# Altium schematic sheet ADC.SchDoc (part 2 of 3)
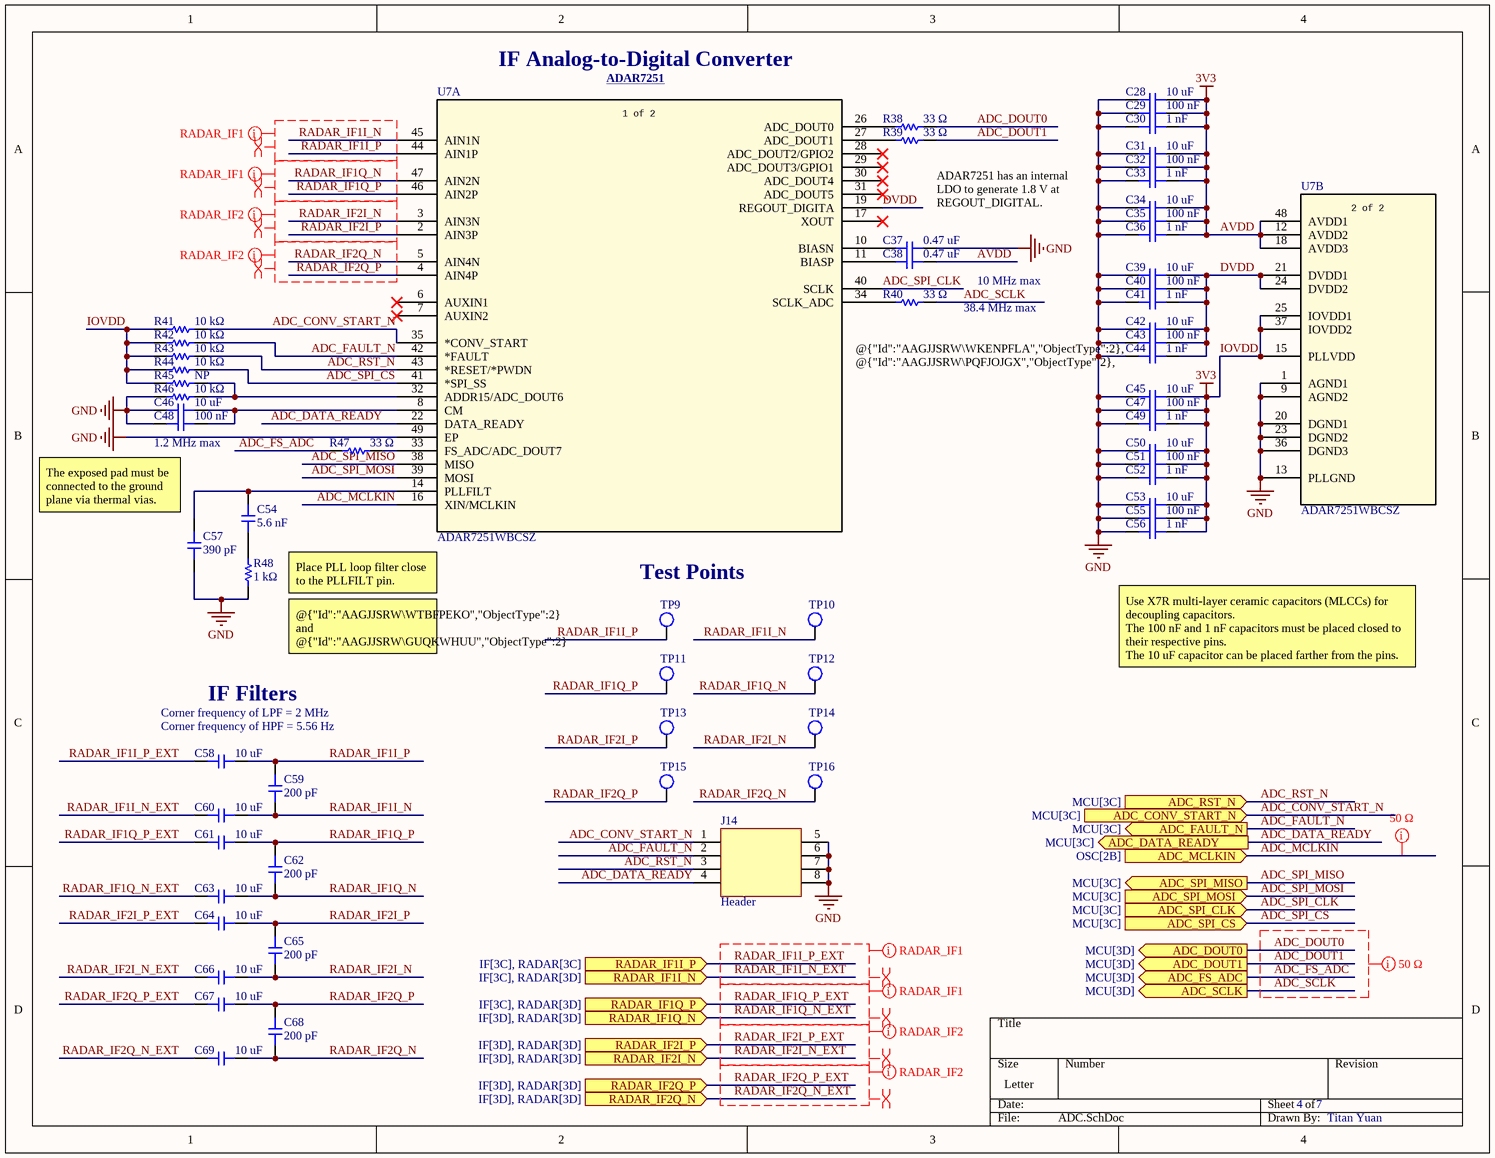
[diagram p1: ADC.SchDoc]
## Library data of the parts
C28 C31 C34 C39 C42 C45 C46 C50 C53 C58 C60 C61 C63 C64 C66 C67 C69 = CAP: 16V 10uF X7R ±10% 0805 Multilayer Ceramic Capacitors MLCC - SMD/SMT ROHS; Manufacturer: Samsung Electro-Mechanics; Manufacturer Part Number: CL21B106KOQNNNE; Value: 10µF; Tolerance: 10%; Voltage Rating: 16 V; Dielectric: Ceramic; Package Size: 0805; Supplier: DigiKey; Supplier Part Number: 1276-2872-1-ND; RoHS: Compliant; Category: Ceramic Capacitors; Stock: 2300374; Pricing: 1=0.08, 10=0.035 (USD); Case/Package: 0805; Case Code (Imperial): 0805; Case Code (Metric): 2012; China RoHS: Compliant; Contact Plating: Tin; Country of Origin: Mainland China, Philippines, South Korea; Depth: 1.25mm; Dielectric Material: Ceramic; Export Control Classification Number (ECCN) Code: EAR99; Height: 1.4mm; Harmonized Tariff Schedule (HTS) Code: 8532.24.00.20; Introduction Date: 2010-04-09; Length: 2mm; Lifecycle Status: Production; Material: Ceramic; Max Operating Temperature: 125°C; Min Operating Temperature: -55°C; Mounting Technology: Surface Mount; Number of Terminals: 2; Radiation Hardening: No; REACH SVHC: Yes; Schedule B: 8532240020, 8532240020|8532240020, 8532240020|8532240020|8532240020, 8532240020|8532240020|8532240020|8532240020; Thickness: 1.397mm; Voltage: 16V; Voltage Rating (DC): 16V; Width: 1.25mm; ComponentLink1URL: https://datasheet.octopart.com:443/CL21B106KOQNNNE-Samsung-Electro-Mechanics-datasheet-136482503.pdf?src-supplier=IHS; ComponentLink1Description: https://datasheet.octopart.com:443/CL21B106KOQNNNE-Samsung-Electro-Mechanics-datasheet-136482503.pdf?src-supplier=IHS; ComponentLink2URL: https://datasheet.octopart.com:443/CL21B106KOQNNNE-Samsung-Electro-Mechanics-datasheet-116891046.pdf?src-supplier=Future+Electronics; ComponentLink2Description: https://datasheet.octopart.com:443/CL21B106KOQNNNE-Samsung-Electro-Mechanics-datasheet-116891046.pdf?src-supplier=Future+Electronics; ComponentLink3URL: https://datasheet.octopart.com:443/CL21B106KOQNNNE-Samsung-Electro-Mechanics-datasheet-81462191.pdf?src-supplier=Future+Electronics; ComponentLink3Description: https://datasheet.octopart.com:443/CL21B106KOQNNNE-Samsung-Electro-Mechanics-datasheet-81462191.pdf?src-supplier=Future+Electronics; ComponentLink4URL: https://datasheet.octopart.com:443/CL21B106KOQNNNE-Samsung-datasheet-12530662.pdf?src-supplier=Future+Electronics; ComponentLink4Description: https://datasheet.octopart.com:443/CL21B106KOQNNNE-Samsung-datasheet-12530662.pdf?src-supplier=Future+Electronics; ComponentLink5URL: https://datasheet.octopart.com:443/CL21B106KOQNNNE-Samsung-datasheet-26669285.pdf?src-supplier=Future+Electronics; ComponentLink5Description: https://datasheet.octopart.com:443/CL21B106KOQNNNE-Samsung-datasheet-26669285.pdf?src-supplier=Future+Electronics; ComponentLink6URL: https://datasheet.octopart.com:443/CL21B106KOQNNNE-Samsung-Electro-Mechanics-datasheet-149045986.pdf?src-supplier=Future+Electronics; ComponentLink6Description: https://datasheet.octopart.com:443/CL21B106KOQNNNE-Samsung-Electro-Mechanics-datasheet-149045986.pdf?src-supplier=Future+Electronics; ComponentLink7URL: https://datasheet.octopart.com/CL21B106KOQNNNE-Samsung-Electro-Mechanics-datasheet-97040617.pdf; ComponentLink7Description: https://datasheet.octopart.com/CL21B106KOQNNNE-Samsung-Electro-Mechanics-datasheet-97040617.pdf; ComponentLink8URL: https://datasheet.octopart.com/CL21B106KOQNNNE-Samsung-Electro-Mechanics-datasheet-8324245.pdf; ComponentLink8Description: https://datasheet.octopart.com/CL21B106KOQNNNE-Samsung-Electro-Mechanics-datasheet-8324245.pdf; ComponentLink9URL: https://datasheet.octopart.com:443/CL21B106KOQNNNE-Samsung-Electro-Mechanics-datasheet-11806859.pdf?src-supplier=Arrow+Electronics; ComponentLink9Description: https://datasheet.octopart.com:443/CL21B106KOQNNNE-Samsung-Electro-Mechanics-datasheet-11806859.pdf?src-supplier=Arrow+Electronics; ComponentLink10URL: https://datasheet.octopart.com:443/CL21B106KOQNNNE-Samsung-datasheet-8326407.pdf?src-supplier=TME; ComponentLink10Description: https://datasheet.octopart.com:443/CL21B106KOQNNNE-Samsung-datasheet-8326407.pdf?src-supplier=TME
C29 C32 C35 C40 C43 C47 C48 C51 C55 = CAP: 25V 100nF X7R ±10% 0402 Multilayer Ceramic Capacitors MLCC - SMD/SMT ROHS; Manufacturer: Samsung Electro-Mechanics; Manufacturer Part Number: CL05B104KA5NNNC; Tolerance: 10%; Voltage Rating: 25 V; Dielectric: Ceramic; Package Size: 0402; Supplier: DigiKey; Supplier Part Number: 1276-6720-1-ND; RoHS: Compliant; Category: Ceramic Capacitors; Stock: 5149468; Pricing: 1=0.08, 10=0.002 (USD); Value: 100nF; Case/Package: 0402; Case Code (Imperial): 0402; Case Code (Metric): 1005; China RoHS: Compliant; Country of Origin: Mainland China, Philippines, South Korea; Dielectric Material: Ceramic; Export Control Classification Number (ECCN) Code: EAR99; Height: 500µm; Harmonized Tariff Schedule (HTS) Code: 8532.24.00.20; Introduction Date: 2009-10-27; Length: 1mm; Lifecycle Status: Production; Material: Ceramic; Max Operating Temperature: 125°C; Min Operating Temperature: -55°C; Mounting Technology: Surface Mount; Number of Terminals: 2; REACH SVHC: Yes; Schedule B: 8532240020, 8532240020|8532240020|8532240020|8532240020|8532240020|8532240020|8532240020|8532240020|8532240020|8532240020|8532240020|8532240020|8532240020|8532240020|8532240020|8532240020|8532240020|8532240020|8532240020|8532240020|8532240020|8532240020|8532240020|85; Thickness: 558.8µm; Voltage Rating (DC): 25V; Width: 500µm; ComponentLink1URL: https://datasheet.octopart.com:443/CL05B104KA5NNNC-Samsung-Electro-Mechanics-datasheet-136876160.pdf?src-supplier=Samsung+SCT; ComponentLink1Description: https://datasheet.octopart.com:443/CL05B104KA5NNNC-Samsung-Electro-Mechanics-datasheet-136876160.pdf?src-supplier=Samsung+SCT; ComponentLink2URL: https://datasheet.octopart.com:443/CL05B104KA5NNNC-Samsung-Electro-Mechanics-datasheet-116890910.pdf?src-supplier=Future+Electronics; ComponentLink2Description: https://datasheet.octopart.com:443/CL05B104KA5NNNC-Samsung-Electro-Mechanics-datasheet-116890910.pdf?src-supplier=Future+Electronics; ComponentLink3URL: https://datasheet.octopart.com:443/CL05B104KA5NNNC-Samsung-Electro-Mechanics-datasheet-104201047.pdf?src-supplier=Future+Electronics; ComponentLink3Description: https://datasheet.octopart.com:443/CL05B104KA5NNNC-Samsung-Electro-Mechanics-datasheet-104201047.pdf?src-supplier=Future+Electronics; ComponentLink4URL: https://datasheet.octopart.com:443/CL05B104KA5NNNC-Samsung-Electro-Mechanics-datasheet-148801811.pdf?src-supplier=Future+Electronics; ComponentLink4Description: https://datasheet.octopart.com:443/CL05B104KA5NNNC-Samsung-Electro-Mechanics-datasheet-148801811.pdf?src-supplier=Future+Electronics; ComponentLink5URL: https://datasheet.octopart.com/CL05B104KA5NNNC-Samsung-Electro-Mechanics-datasheet-97040617.pdf; ComponentLink5Description: https://datasheet.octopart.com/CL05B104KA5NNNC-Samsung-Electro-Mechanics-datasheet-97040617.pdf; ComponentLink6URL: https://datasheet.octopart.com/CL05B104KA5NNNC-Samsung-Electro-Mechanics-datasheet-8324245.pdf; ComponentLink6Description: https://datasheet.octopart.com/CL05B104KA5NNNC-Samsung-Electro-Mechanics-datasheet-8324245.pdf; ComponentLink7URL: https://datasheet.octopart.com/General-Multilayer-Ceramic-Capacitors-Samsung-datasheet-family-111.pdf; ComponentLink7Description: https://datasheet.octopart.com/General-Multilayer-Ceramic-Capacitors-Samsung-datasheet-family-111.pdf; ComponentLink8URL: https://datasheet.octopart.com:443/CL05B104KA5NNNC-Samsung-datasheet-8326407.pdf?src-supplier=TME; ComponentLink8Description: https://datasheet.octopart.com:443/CL05B104KA5NNNC-Samsung-datasheet-8326407.pdf?src-supplier=TME; ComponentLink9URL: http://sigma.octopart.com:80/rohs_certificate/General-Multilayer-Ceramic-Capacitors-Samsung-family-110.pdf?src-supplier=Compliance+Statements; ComponentLink9Description: http://sigma.octopart.com:80/rohs_certificate/General-Multilayer-Ceramic-Capacitors-Samsung-family-110.pdf?src-supplier=Compliance+Statements; ComponentLink10URL: http://sigma.octopart.com:80/rohs_statement/General-Multilayer-Ceramic-Capacitors-Samsung-family-132.pdf?src-supplier=Compliance+Statements; ComponentLink10Description: http://sigma.octopart.com:80/rohs_statement/General-Multilayer-Ceramic-Capacitors-Samsung-family-132.pdf?src-supplier=Compliance+Statements; ComponentLink11URL: http://sigma.octopart.com:80/reach_statement/General-Multilayer-Ceramic-Capacitors-Samsung-family-133.pdf?src-supplier=Compliance+Statements; ComponentLink11Description: http://sigma.octopart.com:80/reach_statement/General-Multilayer-Ceramic-Capacitors-Samsung-family-133.pdf?src-supplier=Compliance+Statements
C30 C33 C36 C41 C44 C49 C52 C56 = CAP: 50V 1nF X7R ±10% 0402 Multilayer Ceramic Capacitors MLCC - SMD/SMT ROHS; Manufacturer: Yageo; Manufacturer Part Number: CC0402KRX7R9BB102; Insulation Resistance: 100GΩ; Temperature Coefficient: 30ppm/°C; Tolerance: 10%; Voltage Rating: 50 V; Dielectric: Ceramic; Package Size: 0402; Supplier: DigiKey; Supplier Part Number: 311-1036-1-ND; RoHS: Compliant; Category: Ceramic Capacitors; Stock: 1584347; Pricing: 1=0.08, 10=0.003, 10000=0.0024 (USD); Value: 1nF; Case/Package: 0402; Case Code (Imperial): 0402; Case Code (Metric): 1005; China RoHS: Compliant; Composition: Ceramic; Country of Origin: Mainland China, Taiwan; Depth: 500µm; Dielectric Material: Ceramic; Export Control Classification Number (ECCN) Code: EAR99; Halogen Free: Halogen Free; Height: 500µm; Harmonized Tariff Schedule (HTS) Code: 8532.24.00.20; Introduction Date: 2003-01-27; Lead Free: Lead Free; Length: 1mm; Lifecycle Status: Production; Material: Ceramic; Max Operating Temperature: 125°C; Min Operating Temperature: -55°C; Mounting Technology: Surface Mount; Pins: 2; Number of Terminals: 2; Radiation Hardening: No; REACH SVHC: Yes; Schedule B: 8532240020, 8532240020|8532240020|8532240020|8532240020|8532240020|8532240020|8532240020|8532240020|8532240020|8532240020|8532240020|8532240020|8532240020|8532240020|8532240020|8532240020|8532240020|8532240020|8532240020|8532240020|8532240020|8532240020|8532240020|85; Termination: SMD/SMT; Thickness: 558.8µm; Voltage: 50V; Voltage Rating (AC): 50V; Voltage Rating (DC): 50V; Width: 500µm; ComponentLink1URL: https://datasheet.octopart.com:443/CC0402KRX7R9BB102-Yageo-datasheet-177165144.pdf?src-supplier=IHS; ComponentLink1Description: https://datasheet.octopart.com:443/CC0402KRX7R9BB102-Yageo-datasheet-177165144.pdf?src-supplier=IHS; ComponentLink2URL: https://datasheet.octopart.com:443/CC0402KRX7R9BB102-Yageo-datasheet-82288757.pdf?src-supplier=Upverter; ComponentLink2Description: https://datasheet.octopart.com:443/CC0402KRX7R9BB102-Yageo-datasheet-82288757.pdf?src-supplier=Upverter; ComponentLink3URL: https://datasheet.octopart.com:443/CC0402KRX7R9BB102-Yageo-datasheet-78855684.pdf?src-supplier=Upverter; ComponentLink3Description: https://datasheet.octopart.com:443/CC0402KRX7R9BB102-Yageo-datasheet-78855684.pdf?src-supplier=Upverter; ComponentLink4URL: https://datasheet.octopart.com/CC0402KRX7R9BB102-Yageo-datasheet-10883670.pdf; ComponentLink4Description: https://datasheet.octopart.com/CC0402KRX7R9BB102-Yageo-datasheet-10883670.pdf; ComponentLink5URL: https://datasheet.octopart.com/CC0402KRX7R9BB102-Yageo-datasheet-12526321.pdf; ComponentLink5Description: https://datasheet.octopart.com/CC0402KRX7R9BB102-Yageo-datasheet-12526321.pdf; ComponentLink6URL: https://datasheet.octopart.com:443/CC0402KRX7R9BB102-Yageo-datasheet-147453679.pdf?src-supplier=Farnell; ComponentLink6Description: https://datasheet.octopart.com:443/CC0402KRX7R9BB102-Yageo-datasheet-147453679.pdf?src-supplier=Farnell; ComponentLink7URL: https://datasheet.octopart.com:443/CC0402KRX7R9BB102-Yageo-datasheet-151948686.pdf?src-supplier=Farnell; ComponentLink7Description: https://datasheet.octopart.com:443/CC0402KRX7R9BB102-Yageo-datasheet-151948686.pdf?src-supplier=Farnell; ComponentLink8URL: https://datasheet.octopart.com:443/CC0402KRX7R9BB102-Phycomp-datasheet-500777.pdf?src-supplier=Farnell; ComponentLink8Description: https://datasheet.octopart.com:443/CC0402KRX7R9BB102-Phycomp-datasheet-500777.pdf?src-supplier=Farnell; ComponentLink9URL: https://datasheet.octopart.com:443/CC0402KRX7R9BB102-Yageo-datasheet-5301394.pdf?src-supplier=Newark; ComponentLink9Description: https://datasheet.octopart.com:443/CC0402KRX7R9BB102-Yageo-datasheet-5301394.pdf?src-supplier=Newark; ComponentLink10URL: https://datasheet.octopart.com:443/CC0402KRX7R9BB102-Yageo-datasheet-62336348.pdf?src-supplier=Newark; ComponentLink10Description: https://datasheet.octopart.com:443/CC0402KRX7R9BB102-Yageo-datasheet-62336348.pdf?src-supplier=Newark; ComponentLink11URL: https://datasheet.octopart.com:443/CC0402KRX7R9BB102-Yageo-datasheet-182878162.pdf?src-supplier=Newark; ComponentLink11Description: https://datasheet.octopart.com:443/CC0402KRX7R9BB102-Yageo-datasheet-182878162.pdf?src-supplier=Newark; ComponentLink12URL: https://datasheet.octopart.com:443/CC0402KRX7R9BB102-Phycomp-datasheet-499490.pdf?src-supplier=element14; ComponentLink12Description: https://datasheet.octopart.com:443/CC0402KRX7R9BB102-Phycomp-datasheet-499490.pdf?src-supplier=element14; ComponentLink13URL: https://datasheet.octopart.com:443/CC0402KRX7R9BB102-Yageo-datasheet-8701427.pdf?src-supplier=element14; ComponentLink13Description: https://datasheet.octopart.com:443/CC0402KRX7R9BB102-Yageo-datasheet-8701427.pdf?src-supplier=element14; ComponentLink14URL: https://datasheet.octopart.com:443/CC0402KRX7R9BB102-Yageo-datasheet-166511530.pdf?src-supplier=Future+Electronics; ComponentLink14Description: https://datasheet.octopart.com:443/CC0402KRX7R9BB102-Yageo-datasheet-166511530.pdf?src-supplier=Future+Electronics; ComponentLink15URL: https://datasheet.octopart.com:443/CC0402KRX7R9BB102-Yageo-datasheet-137700082.pdf?src-supplier=Future+Electronics; ComponentLink15Description: https://datasheet.octopart.com:443/CC0402KRX7R9BB102-Yageo-datasheet-137700082.pdf?src-supplier=Future+Electronics; ComponentLink16URL: https://datasheet.octopart.com:443/CC0402KRX7R9BB102-Yageo-datasheet-137700084.pdf?src-supplier=Future+Electronics; ComponentLink16Description: https://datasheet.octopart.com:443/CC0402KRX7R9BB102-Yageo-datasheet-137700084.pdf?src-supplier=Future+Electronics; ComponentLink17URL: https://datasheet.octopart.com:443/CC0402KRX7R9BB102-Yageo-datasheet-78855685.pdf?src-supplier=Future+Electronics; ComponentLink17Description: https://datasheet.octopart.com:443/CC0402KRX7R9BB102-Yageo-datasheet-78855685.pdf?src-supplier=Future+Electronics; ComponentLink18URL: https://datasheet.octopart.com:443/CC0402KRX7R9BB102-Yageo-datasheet-27626582.pdf?src-supplier=Future+Electronics; ComponentLink18Description: https://datasheet.octopart.com:443/CC0402KRX7R9BB102-Yageo-datasheet-27626582.pdf?src-supplier=Future+Electronics; ComponentLink19URL: https://datasheet.octopart.com:443/CC0402KRX7R9BB102-Yageo-datasheet-24578986.pdf?src-supplier=Future+Electronics; ComponentLink19Description: https://datasheet.octopart.com:443/CC0402KRX7R9BB102-Yageo-datasheet-24578986.pdf?src-supplier=Future+Electronics; ComponentLink20URL: https://datasheet.octopart.com:443/CC0402KRX7R9BB102-Yageo-datasheet-15895757.pdf?src-supplier=Future+Electronics; ComponentLink20Description: https://datasheet.octopart.com:443/CC0402KRX7R9BB102-Yageo-datasheet-15895757.pdf?src-supplier=Future+Electronics; ComponentLink21URL: https://datasheet.octopart.com:443/CC0402KRX7R9BB102-Yageo-datasheet-8324192.pdf?src-supplier=Future+Electronics; ComponentLink21Description: https://datasheet.octopart.com:443/CC0402KRX7R9BB102-Yageo-datasheet-8324192.pdf?src-supplier=Future+Electronics; ComponentLink22URL: https://datasheet.octopart.com:443/CC0402KRX7R9BB102-Yageo-datasheet-68298032.pdf?src-supplier=Future+Electronics; ComponentLink22Description: https://datasheet.octopart.com:443/CC0402KRX7R9BB102-Yageo-datasheet-68298032.pdf?src-supplier=Future+Electronics; ComponentLink23URL: https://datasheet.octopart.com:443/CC0402KRX7R9BB102-Yageo-datasheet-178018854.pdf?src-supplier=Burklin+Elektronik; ComponentLink23Description: https://datasheet.octopart.com:443/CC0402KRX7R9BB102-Yageo-datasheet-178018854.pdf?src-supplier=Burklin+Elektronik; ComponentLink24URL: https://datasheet.octopart.com:443/CC0402KRX7R9BB102-Yageo-Group-datasheet-165992755.pdf?src-supplier=ODG+(Origin+Data+Global); ComponentLink24Description: https://datasheet.octopart.com:443/CC0402KRX7R9BB102-Yageo-Group-datasheet-165992755.pdf?src-supplier=ODG+(Origin+Data+Global); ComponentLink25URL: https://datasheet.octopart.com:443/CC0402KRX7R9BB102-Yageo-datasheet-120101875.pdf?src-supplier=Megastar; ComponentLink25Description: https://datasheet.octopart.com:443/CC0402KRX7R9BB102-Yageo-datasheet-120101875.pdf?src-supplier=Megastar; ComponentLink26URL: https://datasheet.octopart.com:443/CC0402KRX7R9BB102-Yageo-datasheet-118396.pdf?src-supplier=DigiKey; ComponentLink26Description: https://datasheet.octopart.com:443/CC0402KRX7R9BB102-Yageo-datasheet-118396.pdf?src-supplier=DigiKey; ComponentLink27URL: http://sigma.octopart.com:80/rohs_statement/Surface-Mount-Ceramic-Multilayer-Capacitors%3B-General-Purpose-%26-High-Capacitance-Class-2%2C-X7R-Yageo-family-124.pdf?src-supplier=Compliance+Statements; ComponentLink27Description: http://sigma.octopart.com:80/rohs_statement/Surface-Mount-Ceramic-Multilayer-Capacitors%3B-General-Purpose-%26-High-Capacitance-Class-2%2C-X7R-Yageo-family-124.pdf?src-supplier=Compliance+Statements; ComponentLink28URL: http://sigma.octopart.com:80/reach_statement/Surface-Mount-Ceramic-Multilayer-Capacitors%3B-General-Purpose-%26-High-Capacitance-Class-2%2C-X7R-Yageo-family-125.pdf?src-supplier=Compliance+Statements; ComponentLink28Description: http://sigma.octopart.com:80/reach_statement/Surface-Mount-Ceramic-Multilayer-Capacitors%3B-General-Purpose-%26-High-Capacitance-Class-2%2C-X7R-Yageo-family-125.pdf?src-supplier=Compliance+Statements; ComponentLink29URL: http://sigma.octopart.com:80/conflict_mineral_statement/Yageo-company-3.pdf?src-supplier=Compliance+Statements; ComponentLink29Description: http://sigma.octopart.com:80/conflict_mineral_statement/Yageo-company-3.pdf?src-supplier=Compliance+Statements; ComponentLink30URL: http://sigma.octopart.com:80/rohs_statement/Yageo-company-2.pdf?src-supplier=Compliance+Statements; ComponentLink30Description: http://sigma.octopart.com:80/rohs_statement/Yageo-company-2.pdf?src-supplier=Compliance+Statements
C37 C38 = CAP: 0402 0.47 uF 6.3 V ±10% Tolerance X5R SMT Multilayer Ceramic Capacitor; Manufacturer: Murata Electronics; Manufacturer Part Number: GRM155R60J474KE19D; Manufacturer Lifecycle Status: NRND; Voltage Rating: 6.3 V; Value: 470nF; Insulation Resistance: 10GΩ; Voltage: 6.3V; Tolerance: 10%; Dielectric: Ceramic; Package Size: 0402; Supplier: DigiKey; Supplier Part Number: 490-3266-1-ND; RoHS: Compliant; Category: Ceramic Capacitors; Stock: 4006034; Pricing: 1=0.1, 10=0.056, 50=0.039, 100=0.0336, 500=0.02468, 1000=0.02195, 2500=0.01906, 5000=0.01733 (USD); Case/Package: 0402; Case Code (Imperial): 0402; Case Code (Metric): 1005; Depth: 500µm; Dielectric Material: Ceramic; Height: 500µm; Lead Free: Lead Free; Length: 1mm; Lifecycle Status: NRND; Max Operating Temperature: 85°C; Min Operating Temperature: -55°C; Mounting Technology: Surface Mount; Pins: 2; Number of Terminals: 2; Packaging: Cut Tape; Radiation Hardening: No; REACH SVHC: Yes; Schedule B: 8532240020, 8532240020|8532240020, 8532240020|8532240020|8532240020, 8532240020|8532240020|8532240020|8532240020; Termination: SMD/SMT; Thickness: 500µm; Voltage Rating (DC): 6.3V; Width: 500µm; ComponentLink1URL: https://datasheet.octopart.com/GRM155R60J474KE19D-Murata-datasheet-12515295.pdf; ComponentLink1Description: https://datasheet.octopart.com/GRM155R60J474KE19D-Murata-datasheet-12515295.pdf; ComponentLink2URL: https://datasheet.octopart.com/GRM155R60J474KE19D-Murata-datasheet-12510076.pdf; ComponentLink2Description: https://datasheet.octopart.com/GRM155R60J474KE19D-Murata-datasheet-12510076.pdf; ComponentLink3URL: https://datasheet.octopart.com/GRM155R60J474KE19D-Murata-datasheet-11978611.pdf; ComponentLink3Description: https://datasheet.octopart.com/GRM155R60J474KE19D-Murata-datasheet-11978611.pdf; ComponentLink4URL: https://datasheet.octopart.com/GRM155R60J474KE19D-Murata-datasheet-10025737.pdf; ComponentLink4Description: https://datasheet.octopart.com/GRM155R60J474KE19D-Murata-datasheet-10025737.pdf; ComponentLink5URL: https://datasheet.octopart.com/GRM155R60J474KE19D-Murata-datasheet-8819587.pdf; ComponentLink5Description: https://datasheet.octopart.com/GRM155R60J474KE19D-Murata-datasheet-8819587.pdf; ComponentLink6URL: https://datasheet.octopart.com:443/GRM155R60J474KE19D-Murata-datasheet-501912.pdf?src-supplier=Newark; ComponentLink6Description: https://datasheet.octopart.com:443/GRM155R60J474KE19D-Murata-datasheet-501912.pdf?src-supplier=Newark; ComponentLink7URL: https://datasheet.octopart.com:443/GRM155R60J474KE19D-Murata-datasheet-101584254.pdf?src-supplier=element14+APAC; ComponentLink7Description: https://datasheet.octopart.com:443/GRM155R60J474KE19D-Murata-datasheet-101584254.pdf?src-supplier=element14+APAC; ComponentLink8URL: https://datasheet.octopart.com:443/GRM155R60J474KE19D-Murata-datasheet-21400055.pdf?src-supplier=element14+APAC; ComponentLink8Description: https://datasheet.octopart.com:443/GRM155R60J474KE19D-Murata-datasheet-21400055.pdf?src-supplier=element14+APAC; ComponentLink9URL: https://datasheet.octopart.com:443/GRM155R60J474KE19D-Murata-datasheet-514334.pdf?src-supplier=element14; ComponentLink9Description: https://datasheet.octopart.com:443/GRM155R60J474KE19D-Murata-datasheet-514334.pdf?src-supplier=element14; ComponentLink10URL: https://datasheet.octopart.com:443/GRM155R60J474KE19D-Murata-datasheet-14396882.pdf?src-supplier=Future+Electronics; ComponentLink10Description: https://datasheet.octopart.com:443/GRM155R60J474KE19D-Murata-datasheet-14396882.pdf?src-supplier=Future+Electronics; ComponentLink11URL: https://datasheet.octopart.com:443/GRM155R60J474KE19D-Murata-datasheet-13758418.pdf?src-supplier=Future+Electronics; ComponentLink11Description: https://datasheet.octopart.com:443/GRM155R60J474KE19D-Murata-datasheet-13758418.pdf?src-supplier=Future+Electronics; ComponentLink12URL: https://datasheet.octopart.com:443/GRM155R60J474KE19D-Murata-datasheet-44106129.pdf?src-supplier=Future+Electronics; ComponentLink12Description: https://datasheet.octopart.com:443/GRM155R60J474KE19D-Murata-datasheet-44106129.pdf?src-supplier=Future+Electronics; ComponentLink13URL: https://datasheet.octopart.com:443/GRM155R60J474KE19D-Murata-datasheet-141266224.pdf?src-supplier=Ciiva; ComponentLink13Description: https://datasheet.octopart.com:443/GRM155R60J474KE19D-Murata-datasheet-141266224.pdf?src-supplier=Ciiva; ComponentLink14URL: https://datasheet.octopart.com:443/GRM155R60J474KE19D-Murata-datasheet-140689689.pdf?src-supplier=Ciiva; ComponentLink14Description: https://datasheet.octopart.com:443/GRM155R60J474KE19D-Murata-datasheet-140689689.pdf?src-supplier=Ciiva; ComponentLink15URL: https://datasheet.octopart.com:443/GRM155R60J474KE19D-Murata-datasheet-138740666.pdf?src-supplier=Ciiva; ComponentLink15Description: https://datasheet.octopart.com:443/GRM155R60J474KE19D-Murata-datasheet-138740666.pdf?src-supplier=Ciiva; ComponentLink16URL: https://datasheet.octopart.com:443/GRM155R60J474KE19D-Murata-datasheet-81455571.pdf?src-supplier=TME; ComponentLink16Description: https://datasheet.octopart.com:443/GRM155R60J474KE19D-Murata-datasheet-81455571.pdf?src-supplier=TME; ComponentLink17URL: https://datasheet.octopart.com:443/GRM155R60J474KE19D-Murata-datasheet-11801400.pdf?src-supplier=Arrow+Electronics; ComponentLink17Description: https://datasheet.octopart.com:443/GRM155R60J474KE19D-Murata-datasheet-11801400.pdf?src-supplier=Arrow+Electronics; ComponentLink18URL: https://datasheet.octopart.com:443/GRM155R60J474KE19D-Murata-datasheet-632409.pdf?src-supplier=Farnell; ComponentLink18Description: https://datasheet.octopart.com:443/GRM155R60J474KE19D-Murata-datasheet-632409.pdf?src-supplier=Farnell; ComponentLink19URL: https://datasheet.octopart.com:443/GRM155R60J474KE19D-Murata-datasheet-118811.pdf?src-supplier=DigiKey; ComponentLink19Description: https://datasheet.octopart.com:443/GRM155R60J474KE19D-Murata-datasheet-118811.pdf?src-supplier=DigiKey; ComponentLink20URL: http://sigma.octopart.com:80/reach_statement/Murata-company-16.pdf?src-supplier=Compliance+Statements; ComponentLink20Description: http://sigma.octopart.com:80/reach_statement/Murata-company-16.pdf?src-supplier=Compliance+Statements
C54 = CAP: 50V 5.6nF C0G ±5% 0402 Multilayer Ceramic Capacitors MLCC - SMD/SMT ROHS; Manufacturer: Murata Electronics; Manufacturer Part Number: GRM1555C1H562JE01D; Manufacturer Lifecycle Status: IN PRODUCTION; Temperature Coefficient: 30ppm/°C; Tolerance: 5%; Voltage Rating: 50 V; Dielectric: Ceramic; Package Size: 0402; Supplier: DigiKey; Supplier Part Number: 490-GRM1555C1H562JE01DCT-ND; RoHS: Compliant; Category: Ceramic Capacitors; Stock: 13616; Pricing: 1=0.1, 10=0.052, 50=0.0356, 100=0.0307, 500=0.02244, 1000=0.01991, 2500=0.01725, 5000=0.01565 (USD); Value: 5.6nF; Case/Package: 0402; Dielectric Material: Ceramic; Export Control Classification Number (ECCN) Code: EAR99; Height: 500µm; Harmonized Tariff Schedule (HTS) Code: 8532.24.00.20; Introduction Date: 2020-01-27; Length: 1mm; Lifecycle Status: Production; Material: Ceramic; Max Operating Temperature: 125°C; Min Operating Temperature: -55°C; Mounting Technology: Surface Mount; Number of Terminals: 2; REACH SVHC: Yes; Schedule B: 8532240020, 8532240020|8532240020|8532240020|8532240020|8532240020; Thickness: 500µm; Voltage Rating (DC): 50V; Width: 500µm; ComponentLink1URL: https://datasheet.octopart.com:443/GRM1555C1H562JE01D-Murata-datasheet-165579666.pdf?src-supplier=TME; ComponentLink1Description: https://datasheet.octopart.com:443/GRM1555C1H562JE01D-Murata-datasheet-165579666.pdf?src-supplier=TME; ComponentLink2URL: https://datasheet.octopart.com:443/GRM1555C1H562JE01D-Murata-datasheet-141266224.pdf?src-supplier=Ciiva; ComponentLink2Description: https://datasheet.octopart.com:443/GRM1555C1H562JE01D-Murata-datasheet-141266224.pdf?src-supplier=Ciiva; ComponentLink3URL: https://datasheet.octopart.com:443/GRM1555C1H562JE01D-Murata-datasheet-140682534.pdf?src-supplier=Ciiva; ComponentLink3Description: https://datasheet.octopart.com:443/GRM1555C1H562JE01D-Murata-datasheet-140682534.pdf?src-supplier=Ciiva; ComponentLink4URL: https://datasheet.octopart.com:443/GRM1555C1H562JE01D-Murata-datasheet-138739662.pdf?src-supplier=Ciiva; ComponentLink4Description: https://datasheet.octopart.com:443/GRM1555C1H562JE01D-Murata-datasheet-138739662.pdf?src-supplier=Ciiva; ComponentLink5URL: https://datasheet.octopart.com/GRM1555C1H562JE01D-Murata-datasheet-12515295.pdf; ComponentLink5Description: https://datasheet.octopart.com/GRM1555C1H562JE01D-Murata-datasheet-12515295.pdf; ComponentLink6URL: https://datasheet.octopart.com/GRM1555C1H562JE01D-Murata-datasheet-12510076.pdf; ComponentLink6Description: https://datasheet.octopart.com/GRM1555C1H562JE01D-Murata-datasheet-12510076.pdf; ComponentLink7URL: https://datasheet.octopart.com/GRM1555C1H562JE01D-Murata-datasheet-11978611.pdf; ComponentLink7Description: https://datasheet.octopart.com/GRM1555C1H562JE01D-Murata-datasheet-11978611.pdf; ComponentLink8URL: https://datasheet.octopart.com/GRM1555C1H562JE01D-Murata-datasheet-10025737.pdf; ComponentLink8Description: https://datasheet.octopart.com/GRM1555C1H562JE01D-Murata-datasheet-10025737.pdf; ComponentLink9URL: https://datasheet.octopart.com/GRM1555C1H562JE01D-Murata-datasheet-8819587.pdf; ComponentLink9Description: https://datasheet.octopart.com/GRM1555C1H562JE01D-Murata-datasheet-8819587.pdf; ComponentLink10URL: http://sigma.octopart.com:80/reach_statement/Murata-company-16.pdf?src-supplier=Compliance+Statements; ComponentLink10Description: http://sigma.octopart.com:80/reach_statement/Murata-company-16.pdf?src-supplier=Compliance+Statements
C57 = CAP: Capacitor, Ceramic, Multilayer, 50 V, C0G, 0.00039 Uf, Surface Mount, 0402; Manufacturer: Murata Electronics; Manufacturer Part Number: GRM1555C1H391JA01D; Manufacturer Lifecycle Status: IN PRODUCTION; Tolerance: 5%; Voltage Rating: 50 V; Value: 390pF; Temperature Coefficient: 30ppm/°C; Voltage: 50V; Dielectric: Ceramic; Package Size: 0402; Supplier: DigiKey; Supplier Part Number: 490-1296-1-ND; RoHS: Compliant; Category: Ceramic Capacitors; Stock: 144832; Pricing: 1=0.1, 10=0.033, 50=0.0224, 100=0.0191, 500=0.01364, 1000=0.01196, 2500=0.01021, 5000=0.00916 (USD); Case/Package: 0402; Case Code (Imperial): 0402; Case Code (Metric): 1005; Depth: 500µm; Dielectric Material: Ceramic; Export Control Classification Number (ECCN) Code: EAR99; Height: 500µm; Harmonized Tariff Schedule (HTS) Code: 8532.24.00.20; Introduction Date: 2003-10-14; Lead Free: Lead Free; Length: 1mm; Lifecycle Status: Production; Material: Ceramic; Max Operating Temperature: 125°C; Min Operating Temperature: -55°C; Mounting Technology: Surface Mount; Number of Terminals: 2; Packaging: Cut Tape; Radiation Hardening: No; REACH SVHC: Yes; Schedule B: 8532240020, 8532240020|8532240020, 8532240020|8532240020|8532240020, 8532240020|8532240020|8532240020|8532240020; Termination: SMD/SMT; Thickness: 500µm; Voltage Rating (DC): 50V; Width: 500µm; ComponentLink1URL: https://datasheet.octopart.com:443/GRM1555C1H391JA01D-Murata-datasheet-11756562.pdf?src-supplier=_legacy+Avnet; ComponentLink1Description: https://datasheet.octopart.com:443/GRM1555C1H391JA01D-Murata-datasheet-11756562.pdf?src-supplier=_legacy+Avnet; ComponentLink2URL: https://datasheet.octopart.com:443/GRM1555C1H391JA01D-Murata-datasheet-46741834.pdf?src-supplier=element14+APAC; ComponentLink2Description: https://datasheet.octopart.com:443/GRM1555C1H391JA01D-Murata-datasheet-46741834.pdf?src-supplier=element14+APAC; ComponentLink3URL: https://datasheet.octopart.com:443/GRM1555C1H391JA01D-Murata-datasheet-14396425.pdf?src-supplier=Future+Electronics; ComponentLink3Description: https://datasheet.octopart.com:443/GRM1555C1H391JA01D-Murata-datasheet-14396425.pdf?src-supplier=Future+Electronics; ComponentLink4URL: https://datasheet.octopart.com:443/GRM1555C1H391JA01D-Murata-datasheet-22122223.pdf?src-supplier=Future+Electronics; ComponentLink4Description: https://datasheet.octopart.com:443/GRM1555C1H391JA01D-Murata-datasheet-22122223.pdf?src-supplier=Future+Electronics; ComponentLink5URL: https://datasheet.octopart.com:443/GRM1555C1H391JA01D-Murata-datasheet-44105932.pdf?src-supplier=Future+Electronics; ComponentLink5Description: https://datasheet.octopart.com:443/GRM1555C1H391JA01D-Murata-datasheet-44105932.pdf?src-supplier=Future+Electronics; ComponentLink6URL: https://datasheet.octopart.com:443/GRM1555C1H391JA01D-Murata-datasheet-165579666.pdf?src-supplier=TME; ComponentLink6Description: https://datasheet.octopart.com:443/GRM1555C1H391JA01D-Murata-datasheet-165579666.pdf?src-supplier=TME; ComponentLink7URL: https://datasheet.octopart.com:443/GRM1555C1H391JA01D-Murata-datasheet-83054218.pdf?src-supplier=TME; ComponentLink7Description: https://datasheet.octopart.com:443/GRM1555C1H391JA01D-Murata-datasheet-83054218.pdf?src-supplier=TME; ComponentLink8URL: https://datasheet.octopart.com:443/GRM1555C1H391JA01D-Murata-datasheet-141266224.pdf?src-supplier=Ciiva; ComponentLink8Description: https://datasheet.octopart.com:443/GRM1555C1H391JA01D-Murata-datasheet-141266224.pdf?src-supplier=Ciiva; ComponentLink9URL: https://datasheet.octopart.com:443/GRM1555C1H391JA01D-Murata-datasheet-140682023.pdf?src-supplier=Ciiva; ComponentLink9Description: https://datasheet.octopart.com:443/GRM1555C1H391JA01D-Murata-datasheet-140682023.pdf?src-supplier=Ciiva; ComponentLink10URL: https://datasheet.octopart.com:443/GRM1555C1H391JA01D-Murata-datasheet-138739583.pdf?src-supplier=Ciiva; ComponentLink10Description: https://datasheet.octopart.com:443/GRM1555C1H391JA01D-Murata-datasheet-138739583.pdf?src-supplier=Ciiva; ComponentLink11URL: https://datasheet.octopart.com/GRM1555C1H391JA01D-Murata-datasheet-12515295.pdf; ComponentLink11Description: https://datasheet.octopart.com/GRM1555C1H391JA01D-Murata-datasheet-12515295.pdf; ComponentLink12URL: https://datasheet.octopart.com/GRM1555C1H391JA01D-Murata-datasheet-12510076.pdf; ComponentLink12Description: https://datasheet.octopart.com/GRM1555C1H391JA01D-Murata-datasheet-12510076.pdf; ComponentLink13URL: https://datasheet.octopart.com/GRM1555C1H391JA01D-Murata-datasheet-11978611.pdf; ComponentLink13Description: https://datasheet.octopart.com/GRM1555C1H391JA01D-Murata-datasheet-11978611.pdf; ComponentLink14URL: https://datasheet.octopart.com/GRM1555C1H391JA01D-Murata-datasheet-10025737.pdf; ComponentLink14Description: https://datasheet.octopart.com/GRM1555C1H391JA01D-Murata-datasheet-10025737.pdf; ComponentLink15URL: https://datasheet.octopart.com/GRM1555C1H391JA01D-Murata-datasheet-8819587.pdf; ComponentLink15Description: https://datasheet.octopart.com/GRM1555C1H391JA01D-Murata-datasheet-8819587.pdf; ComponentLink16URL: https://datasheet.octopart.com:443/GRM1555C1H391JA01D-Murata-datasheet-102.pdf?src-supplier=DigiKey; ComponentLink16Description: https://datasheet.octopart.com:443/GRM1555C1H391JA01D-Murata-datasheet-102.pdf?src-supplier=DigiKey; ComponentLink17URL: http://sigma.octopart.com:80/reach_statement/Murata-company-16.pdf?src-supplier=Compliance+Statements; ComponentLink17Description: http://sigma.octopart.com:80/reach_statement/Murata-company-16.pdf?src-supplier=Compliance+Statements
C59 C62 C65 C68 = CAP: Ceramic Capacitor, Multilayer, Ceramic, 50V, 5% +Tol, 5% -Tol, C0G, 0+-30ppm/Celcius TC, 200pF, Surface Mount, 0603...; Manufacturer: Samsung Electro-Mechanics; Manufacturer Part Number: CL10C201JB8NNNC; Temperature Coefficient: 30ppm/°C; Tolerance: 5%; Voltage Rating: 50 V; Dielectric: Ceramic; Package Size: 0603; Supplier: DigiKey; Supplier Part Number: 1276-2222-1-ND; RoHS: Compliant; Category: Ceramic Capacitors; Stock: 177973; Pricing: 1=0.1, 10=0.049, 50=0.0336, 100=0.0289, 500=0.02102, 1000=0.01863 (USD); Value: 200pF; Case/Package: 0603; Case Code (Imperial): 0603; Case Code (Metric): 1608; China RoHS: Compliant; Country of Origin: Mainland China, Philippines, South Korea; Depth: 800µm; Dielectric Material: Ceramic; Export Control Classification Number (ECCN) Code: EAR99; Height: 900µm; Harmonized Tariff Schedule (HTS) Code: 8532.24.00.20; Introduction Date: 2010-07-30; Length: 1.6mm; Lifecycle Status: Production; Material: Ceramic; Max Operating Temperature: 125°C; Min Operating Temperature: -55°C; Mounting Technology: Surface Mount; Number of Terminals: 2; Radiation Hardening: No; REACH SVHC: Yes; Schedule B: 8532240020, 8532240020|8532240020, 8532240020|8532240020|8532240020, 8532240020|8532240020|8532240020|8532240020; Thickness: 889µm; Voltage Rating (DC): 50V; Width: 800µm; ComponentLink1URL: https://datasheet.octopart.com:443/CL10C201JB8NNNC-Samsung-Electro-Mechanics-datasheet-137472383.pdf?src-supplier=IHS; ComponentLink1Description: https://datasheet.octopart.com:443/CL10C201JB8NNNC-Samsung-Electro-Mechanics-datasheet-137472383.pdf?src-supplier=IHS; ComponentLink2URL: https://datasheet.octopart.com:443/CL10C201JB8NNNC-Samsung-Electro-Mechanics-datasheet-110226353.pdf?src-supplier=Future+Electronics; ComponentLink2Description: https://datasheet.octopart.com:443/CL10C201JB8NNNC-Samsung-Electro-Mechanics-datasheet-110226353.pdf?src-supplier=Future+Electronics; ComponentLink3URL: https://datasheet.octopart.com:443/CL10C201JB8NNNC-Samsung-Electro-Mechanics-datasheet-81462002.pdf?src-supplier=Future+Electronics; ComponentLink3Description: https://datasheet.octopart.com:443/CL10C201JB8NNNC-Samsung-Electro-Mechanics-datasheet-81462002.pdf?src-supplier=Future+Electronics; ComponentLink4URL: https://datasheet.octopart.com:443/CL10C201JB8NNNC-Samsung-datasheet-42280589.pdf?src-supplier=Future+Electronics; ComponentLink4Description: https://datasheet.octopart.com:443/CL10C201JB8NNNC-Samsung-datasheet-42280589.pdf?src-supplier=Future+Electronics; ComponentLink5URL: https://datasheet.octopart.com:443/CL10C201JB8NNNC-Samsung-datasheet-15238953.pdf?src-supplier=Future+Electronics; ComponentLink5Description: https://datasheet.octopart.com:443/CL10C201JB8NNNC-Samsung-datasheet-15238953.pdf?src-supplier=Future+Electronics; ComponentLink6URL: https://datasheet.octopart.com:443/CL10C201JB8NNNC-Samsung-datasheet-26669146.pdf?src-supplier=Future+Electronics; ComponentLink6Description: https://datasheet.octopart.com:443/CL10C201JB8NNNC-Samsung-datasheet-26669146.pdf?src-supplier=Future+Electronics; ComponentLink7URL: https://datasheet.octopart.com:443/CL10C201JB8NNNC-Samsung-Electro-Mechanics-datasheet-149136898.pdf?src-supplier=Future+Electronics; ComponentLink7Description: https://datasheet.octopart.com:443/CL10C201JB8NNNC-Samsung-Electro-Mechanics-datasheet-149136898.pdf?src-supplier=Future+Electronics; ComponentLink8URL: https://datasheet.octopart.com/CL10C201JB8NNNC-Samsung-Electro-Mechanics-datasheet-97040617.pdf; ComponentLink8Description: https://datasheet.octopart.com/CL10C201JB8NNNC-Samsung-Electro-Mechanics-datasheet-97040617.pdf; ComponentLink9URL: https://datasheet.octopart.com/CL10C201JB8NNNC-Samsung-Electro-Mechanics-datasheet-8324245.pdf; ComponentLink9Description: https://datasheet.octopart.com/CL10C201JB8NNNC-Samsung-Electro-Mechanics-datasheet-8324245.pdf; ComponentLink10URL: https://datasheet.octopart.com:443/CL10C201JB8NNNC-Samsung-Electro-Mechanics-datasheet-11541288.pdf?src-supplier=Arrow+Electronics; ComponentLink10Description: https://datasheet.octopart.com:443/CL10C201JB8NNNC-Samsung-Electro-Mechanics-datasheet-11541288.pdf?src-supplier=Arrow+Electronics
J14 = CONN_2x4_2.54mm_PinHeader_Vertical: Pin Header, Board-to-Board, 2.54 mm, 2 Rows, 8 Contacts, Through Hole, TSW Series; Manufacturer: Samtec; Manufacturer Part Number: TSW-104-07-F-D; Manufacturer Lifecycle Status: PRODUCTION; Connector Type: Male Pin; Gender: Male; Max Current Rating: 7.6A; Max Voltage Rating (AC): 550V; Number of Contacts: 8; Pitch: 2.54mm; Supplier: DigiKey; Supplier Part Number: SAM8996-ND; RoHS: Compliant; Category: Headers and Wire Housings; Stock: 18480; Pricing: 1=0.43, 50=0.37, 100=0.31, 500=0.26, 1000=0.22, 2000=0.19, 5000=0.17, 10000=0.15 (USD); Color: Black; Contact Material: Bronze; Contact Mating Length: 5.842mm; Contact Plating: Gold; Depth: 5.08mm; Housing Color: Black; Housing Material: Polyester; Lead Pitch: 2.54mm; Length: 10.16mm; Lifecycle Status: Production; Max Operating Temperature: 125°C; Min Operating Temperature: -55°C; Mounting Technology: Through Hole; Number of Positions: 8; Number of Rows: 2; Orientation: Straight; Radiation Hardening: No; REACH SVHC: No; Row Spacing: 2.54mm; Termination: Solder; ComponentLink1URL: https://datasheet.octopart.com:443/TSW-104-07-F-D-Samtec-datasheet-97325576.pdf?src-supplier=Sager+Electronics; ComponentLink1Description: https://datasheet.octopart.com:443/TSW-104-07-F-D-Samtec-datasheet-97325576.pdf?src-supplier=Sager+Electronics; ComponentLink2URL: https://datasheet.octopart.com:443/TSW-104-07-F-D-Samtec-datasheet-151455181.pdf?src-supplier=Sager+Electronics; ComponentLink2Description: https://datasheet.octopart.com:443/TSW-104-07-F-D-Samtec-datasheet-151455181.pdf?src-supplier=Sager+Electronics; ComponentLink3URL: https://sigma.octopart.com:443/97325577/technical_drawing/Samtec-TSW-104-07-F-D.pdf?src-supplier=HQonline; ComponentLink3Description: https://sigma.octopart.com:443/97325577/technical_drawing/Samtec-TSW-104-07-F-D.pdf?src-supplier=HQonline; ComponentLink4URL: https://datasheet.octopart.com:443/TSW-104-07-F-D-Samtec-datasheet-136646178.pdf?src-supplier=Master+Electronics; ComponentLink4Description: https://datasheet.octopart.com:443/TSW-104-07-F-D-Samtec-datasheet-136646178.pdf?src-supplier=Master+Electronics; ComponentLink5URL: https://datasheet.octopart.com:443/TSW-104-07-F-D-Samtec-datasheet-182948906.pdf?src-supplier=JRH+Electronics; ComponentLink5Description: https://datasheet.octopart.com:443/TSW-104-07-F-D-Samtec-datasheet-182948906.pdf?src-supplier=JRH+Electronics; ComponentLink6URL: https://datasheet.octopart.com:443/TSW-104-07-F-D-Samtec-datasheet-160657603.pdf?src-supplier=Toby+Electronics; ComponentLink6Description: https://datasheet.octopart.com:443/TSW-104-07-F-D-Samtec-datasheet-160657603.pdf?src-supplier=Toby+Electronics; ComponentLink7URL: https://datasheet.octopart.com:443/TSW-104-07-F-D-Samtec-datasheet-116539033.pdf?src-supplier=Toby+Electronics; ComponentLink7Description: https://datasheet.octopart.com:443/TSW-104-07-F-D-Samtec-datasheet-116539033.pdf?src-supplier=Toby+Electronics; ComponentLink8URL: https://datasheet.octopart.com:443/TSW-104-07-F-D-Samtec-datasheet-116536310.pdf?src-supplier=Toby+Electronics; ComponentLink8Description: https://datasheet.octopart.com:443/TSW-104-07-F-D-Samtec-datasheet-116536310.pdf?src-supplier=Toby+Electronics; ComponentLink9URL: https://datasheet.octopart.com:443/TSW-104-07-F-D-Samtec-datasheet-116615235.pdf?src-supplier=Electro+Sonic; ComponentLink9Description: https://datasheet.octopart.com:443/TSW-104-07-F-D-Samtec-datasheet-116615235.pdf?src-supplier=Electro+Sonic; ComponentLink10URL: https://datasheet.octopart.com/TSW-104-07-F-D-Samtec-datasheet-86818365.pdf; ComponentLink10Description: https://datasheet.octopart.com/TSW-104-07-F-D-Samtec-datasheet-86818365.pdf; ComponentLink11URL: https://datasheet.octopart.com:443/TSW-104-07-F-D-Samtec-datasheet-62107121.pdf?src-supplier=Newark; ComponentLink11Description: https://datasheet.octopart.com:443/TSW-104-07-F-D-Samtec-datasheet-62107121.pdf?src-supplier=Newark; ComponentLink12URL: https://datasheet.octopart.com:443/TSW-104-07-F-D-Samtec-datasheet-11047283.pdf?src-supplier=Newark; ComponentLink12Description: https://datasheet.octopart.com:443/TSW-104-07-F-D-Samtec-datasheet-11047283.pdf?src-supplier=Newark
R38-R40 R47 = RES: Thick Film Resistors – SMD; YAGEO; RC0402FR-0733RL; 33 Ohm; 0402; 1 %; Thick Film; Tolerance: 1%; Power Dissipation: 62.5mW; Power Rating: 63mW; Value: 33Ω; Temperature Coefficient: 100ppm/°C; Voltage Rating (AC): 50V; Manufacturer: Yageo; Manufacturer Part Number: RC0402FR-0733RL; Package Size: 0402; Supplier: DigiKey; Supplier Part Number: 311-33.0LRCT-ND; RoHS: Compliant; Category: Chip SMD Resistors; Stock: 2382852; Pricing: 1=0.1, 10=0.007, 25=0.0068, 50=0.0062, 100=0.0031 (USD); Case/Package: 0402; Case Code (Imperial): 0402; China RoHS: Non-Compliant; Composition: Thick Film; Depth: 500µm; Height: 350µm; Lead Free: Lead Free; Length: 1mm; Lifecycle Status: Production; Max Operating Temperature: 155°C; Military Standard: Not; Min Operating Temperature: -55°C; Mounting Technology: Surface Mount; Pins: 2; Number of Terminals: 2; Packaging: Cut Tape; REACH SVHC: Yes; Schedule B: 8533210045, 8533210045|8533210045, 8533210045|8533210045|8533210045, 8533210045|8533210045|8533210045|8533210045; Termination: SMD/SMT; Voltage Rating (DC): 50V; Width: 500µm; Working Voltage: 50V; ComponentLink1URL: https://datasheet.octopart.com:443/RC0402FR-0733RL-Yageo-datasheet-175887523.pdf?src-supplier=Newark; ComponentLink1Description: https://datasheet.octopart.com:443/RC0402FR-0733RL-Yageo-datasheet-175887523.pdf?src-supplier=Newark; ComponentLink2URL: https://datasheet.octopart.com:443/RC0402FR-0733RL-Yageo-Group-datasheet-190305687.pdf?src-supplier=Newark; ComponentLink2Description: https://datasheet.octopart.com:443/RC0402FR-0733RL-Yageo-Group-datasheet-190305687.pdf?src-supplier=Newark; ComponentLink3URL: https://datasheet.octopart.com:443/RC0402FR-0733RL-Yageo-datasheet-12531192.pdf?src-supplier=Newark; ComponentLink3Description: https://datasheet.octopart.com:443/RC0402FR-0733RL-Yageo-datasheet-12531192.pdf?src-supplier=Newark; ComponentLink4URL: https://datasheet.octopart.com:443/RC0402FR-0733RL-Yageo-datasheet-8324527.pdf?src-supplier=Newark; ComponentLink4Description: https://datasheet.octopart.com:443/RC0402FR-0733RL-Yageo-datasheet-8324527.pdf?src-supplier=Newark; ComponentLink5URL: https://datasheet.octopart.com:443/RC0402FR-0733RL-Yageo-datasheet-62067350.pdf?src-supplier=Newark; ComponentLink5Description: https://datasheet.octopart.com:443/RC0402FR-0733RL-Yageo-datasheet-62067350.pdf?src-supplier=Newark; ComponentLink6URL: https://datasheet.octopart.com:443/RC0402FR-0733RL-Yageo-datasheet-103092701.pdf?src-supplier=Upverter; ComponentLink6Description: https://datasheet.octopart.com:443/RC0402FR-0733RL-Yageo-datasheet-103092701.pdf?src-supplier=Upverter; ComponentLink7URL: https://datasheet.octopart.com:443/RC0402FR-0733RL-Yageo-datasheet-98239111.pdf?src-supplier=Upverter; ComponentLink7Description: https://datasheet.octopart.com:443/RC0402FR-0733RL-Yageo-datasheet-98239111.pdf?src-supplier=Upverter; ComponentLink8URL: https://datasheet.octopart.com:443/RC0402FR-0733RL-Yageo-datasheet-10408619.pdf?src-supplier=element14+APAC; ComponentLink8Description: https://datasheet.octopart.com:443/RC0402FR-0733RL-Yageo-datasheet-10408619.pdf?src-supplier=element14+APAC; ComponentLink9URL: https://datasheet.octopart.com:443/RC0402FR-0733RL-Yageo-datasheet-8329306.pdf?src-supplier=element14; ComponentLink9Description: https://datasheet.octopart.com:443/RC0402FR-0733RL-Yageo-datasheet-8329306.pdf?src-supplier=element14; ComponentLink10URL: https://datasheet.octopart.com:443/RC0402FR-0733RL-Yageo-datasheet-505231.pdf?src-supplier=element14; ComponentLink10Description: https://datasheet.octopart.com:443/RC0402FR-0733RL-Yageo-datasheet-505231.pdf?src-supplier=element14; ComponentLink11URL: https://datasheet.octopart.com:443/RC0402FR-0733RL-Yageo-Group-datasheet-176638170.pdf?src-supplier=Future+Electronics; ComponentLink11Description: https://datasheet.octopart.com:443/RC0402FR-0733RL-Yageo-Group-datasheet-176638170.pdf?src-supplier=Future+Electronics; ComponentLink12URL: https://datasheet.octopart.com:443/RC0402FR-0733RL-Yageo-datasheet-164759695.pdf?src-supplier=Future+Electronics; ComponentLink12Description: https://datasheet.octopart.com:443/RC0402FR-0733RL-Yageo-datasheet-164759695.pdf?src-supplier=Future+Electronics; ComponentLink13URL: https://datasheet.octopart.com:443/RC0402FR-0733RL-Yageo-datasheet-137700087.pdf?src-supplier=Future+Electronics; ComponentLink13Description: https://datasheet.octopart.com:443/RC0402FR-0733RL-Yageo-datasheet-137700087.pdf?src-supplier=Future+Electronics; ComponentLink14URL: https://datasheet.octopart.com:443/RC0402FR-0733RL-Yageo-datasheet-175423674.pdf?src-supplier=SOS+electronic; ComponentLink14Description: https://datasheet.octopart.com:443/RC0402FR-0733RL-Yageo-datasheet-175423674.pdf?src-supplier=SOS+electronic; ComponentLink15URL: https://datasheet.octopart.com:443/RC0402FR-0733RL-Yageo-datasheet-148775077.pdf?src-supplier=TME; ComponentLink15Description: https://datasheet.octopart.com:443/RC0402FR-0733RL-Yageo-datasheet-148775077.pdf?src-supplier=TME; ComponentLink16URL: https://datasheet.octopart.com/RC0402FR-0733RL-Yageo-datasheet-73766026.pdf; ComponentLink16Description: https://datasheet.octopart.com/RC0402FR-0733RL-Yageo-datasheet-73766026.pdf; ComponentLink17URL: https://datasheet.octopart.com:443/RC0402FR-0733RL-Yageo-datasheet-13691069.pdf?src-supplier=Farnell; ComponentLink17Description: https://datasheet.octopart.com:443/RC0402FR-0733RL-Yageo-datasheet-13691069.pdf?src-supplier=Farnell; ComponentLink18URL: http://sigma.octopart.com:80/conflict_mineral_statement/Yageo-company-3.pdf?src-supplier=Compliance+Statements; ComponentLink18Description: http://sigma.octopart.com:80/conflict_mineral_statement/Yageo-company-3.pdf?src-supplier=Compliance+Statements; ComponentLink19URL: http://sigma.octopart.com:80/rohs_statement/Yageo-company-2.pdf?src-supplier=Compliance+Statements; ComponentLink19Description: http://sigma.octopart.com:80/rohs_statement/Yageo-company-2.pdf?src-supplier=Compliance+Statements